# EAGLE schematic Schematic_3ph_MOSFET_Bridge (EAGLE 9.7.0)
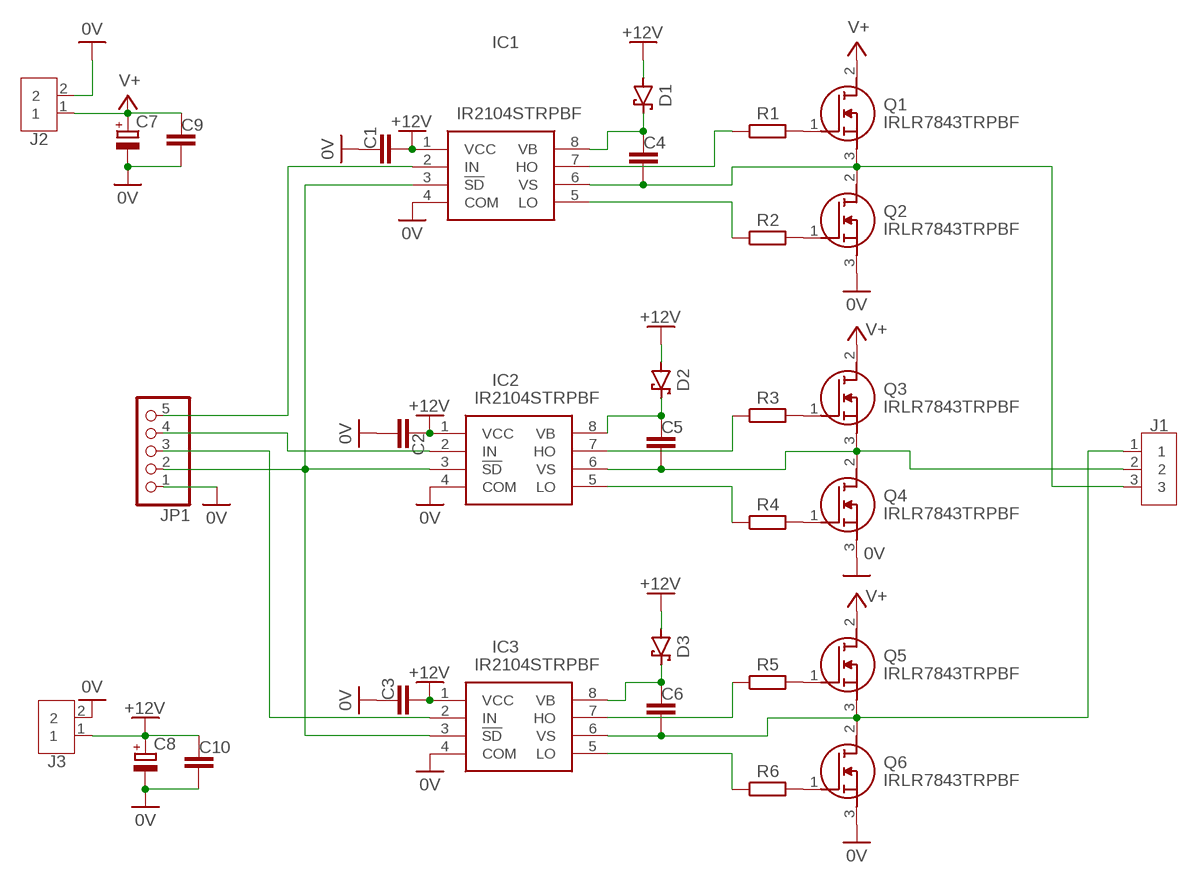
[diagram p0: schematic, sheet 1]

## Parts
C1  CAPACITOR_CHIP-0805(2012-METRIC)  [CAPC2012X110]
C2  CAPACITOR_CHIP-0805(2012-METRIC)  [CAPC2012X110]
C3  CAPACITOR_CHIP-0805(2012-METRIC)  [CAPC2012X110]
C4  CAPACITOR_CHIP-0805(2012-METRIC)  [CAPC2012X110]
C5  CAPACITOR_CHIP-0805(2012-METRIC)  [CAPC2012X110]
C6  CAPACITOR_CHIP-0805(2012-METRIC)  [CAPC2012X110]
C7  C-POL_RADIAL-11MM-DIA  [CAPPRD508W65D1000H1100B]
C8  C-POL_TANTALUM-2412(6032-METRIC)  [CAPMP6032X280N]
C9  CAPACITOR_CHIP-0805(2012-METRIC)  [CAPC2012X110]
C10  CAPACITOR_CHIP-0805(2012-METRIC)  [CAPC2012X110]
D1  MBR0520LT1G  SCHOTTKY_MBR0520LT1GDO-219  [SODFL3718X115]
D2  MBR0520LT1G  SCHOTTKY_MBR0520LT1GDO-219  [SODFL3718X115]
D3  MBR0520LT1G  SCHOTTKY_MBR0520LT1GDO-219  [SODFL3718X115]
IC1  IR2104STRPBF  [SOIC127P600X175-8N]
IC2  IR2104STRPBF  [SOIC127P600X175-8N]
IC3  IR2104STRPBF  [SOIC127P600X175-8N]
J1  TERM-BLK-3P  2828XX-3282837-3  [TERMBLK_508-3N]
J2  TERM-BLK-2P  2828XX-2282837-2  [TERMBLK_508-2N]
J3  TERM-BLK-2P  2828XX-2282837-2  [TERMBLK_508-2N]
JP1  PINHD-1X5  [1X05]
Q1  IRLR7843TRPBF  [IRLR7843TRPBF]
Q2  IRLR7843TRPBF  [IRLR7843TRPBF]
Q3  IRLR7843TRPBF  [IRLR7843TRPBF]
Q4  IRLR7843TRPBF  [IRLR7843TRPBF]
Q5  IRLR7843TRPBF  [IRLR7843TRPBF]
Q6  IRLR7843TRPBF  [IRLR7843TRPBF]
R1  RESISTOR__CHIP-0805(2012-METRIC)  [RESC2012X65]
R2  RESISTOR__CHIP-0805(2012-METRIC)  [RESC2012X65]
R3  RESISTOR__CHIP-0805(2012-METRIC)  [RESC2012X65]
R4  RESISTOR__CHIP-0805(2012-METRIC)  [RESC2012X65]
R5  RESISTOR__CHIP-0805(2012-METRIC)  [RESC2012X65]
R6  RESISTOR__CHIP-0805(2012-METRIC)  [RESC2012X65]

## Nets
0V: C1.1 C2.2 C3.1 C7.2(-) C8.2(-) C9.2 C10.2 IC1.4(COM) IC2.4(COM) IC3.4(COM) J2.2 J3.2 JP1.1 Q2.3(S) Q4.3(S) Q6.3(S)
+12V: C1.2 C2.1 C3.2 C8.1(+) C10.1 D1.2(A) D2.2(A) D3.2(A) IC1.1(VCC) IC2.1(VCC) IC3.1(VCC) J3.1
N$1: C4.2 IC1.6(VS) J1.3 Q1.3(S) Q2.2(D)
N$2: C5.2 IC2.6(VS) J1.2 Q3.3(S) Q4.2(D)
N$3: C6.2 IC3.6(VS) J1.1 Q5.3(S) Q6.2(D)
N$4: Q1.1(G) R1.2
N$5: Q2.1(G) R2.2
N$6: Q3.1(G) R3.2
N$7: Q4.1(G) R4.2
N$8: Q5.1(G) R5.2
N$9: Q6.1(G) R6.2
N$10: IC1.7(HO) R1.1
N$11: IC1.5(LO) R2.1
N$12: IC2.7(HO) R3.1
N$13: IC2.5(LO) R4.1
N$14: IC3.7(HO) R5.1
N$15: IC3.5(LO) R6.1
N$16: IC1.3(!SD) IC2.3(!SD) IC3.3(!SD) JP1.2
N$17: IC1.2(IN) JP1.5
N$18: IC2.2(IN) JP1.4
N$19: IC3.2(IN) JP1.3
N$20: C4.1 D1.1(C) IC1.8(VB)
N$21: C5.1 D2.1(C) IC2.8(VB)
N$22: C6.1 D3.1(C) IC3.8(VB)
V+: C7.1(+) C9.1 J2.1 Q1.2(D) Q3.2(D) Q5.2(D)

## Library data of the parts
C1-C6 C9 C10 = Tinkercad:CAPACITOR: Capacitor - Generic; CATEGORY: Capacitor
C7 C8 = Capacitor:C-POL: Capacitor Polarised - Generic; CATEGORY: Capacitor
D1-D3 = Diode:SCHOTTKY_: Schottky Diode - Popular parts; CATEGORY: Diode; DESCRIPTION: DIODE SCHOTTKY 20V 500MA SOD123; MANUFACTURER: ON Semiconductor; MPN: MBR0520LT1G; SUB-CATEGORY: Schottky
IC1-IC3 = IR2104S:IR2104STRPBF: MOSFET Driver, Dual, 8 Pin, Plastic, SOP Source: Datasheet <https://www.infineon.com/cms/en/product/power/gate-driver-ics/?>; DESCRIPTION: MOSFET Driver, Dual, 8 Pin, Plastic, SOP; HEIGHT: 1.75mm; MANUFACTURER_NAME: Infineon; MANUFACTURER_PART_NUMBER: IR2104STRPBF; MOUSER_PART_NUMBER: 942-IR2104STRPBF; MOUSER_PRICE-STOCK: https://www.mouser.co.uk/ProductDetail/Infineon-Technologies/IR2104STRPBF?qs=2r01AXMCG3NCbspWVHqTYw%3D%3D
J1 = Connector:2828XX-3: 3 Position Wire to Board Terminal Block Horizontal with Board Datasheet <https://www.te.com.cn/commerce/DocumentDelivery/DDEController?Action=showdoc&DocId=Catalog+Section%7F1308389_EUROSTYLE_TERMINAL_BLOCKS%7F0607%7Fpdf%7FEnglish%7FENG_CS_1308389_EUROSTYLE_TERMINAL_BLOCKS_0607.pdf%7F2-282837-5>; CATEGORY: Connector; DESCRIPTION: TERM BLK 3P SIDE ENT 5.08mm PCB; MANUFACTURER: TE Connectivity; MPN: 282837-3; OPERATING_TEMPERATURE: -40°C to +105°C; PART_STATUS: Active; PITCH: 0.200" (5.08mm); ROHS_COMPLIANCE: RoHS Compliant; SERIES: Buchanan; SUBCATEGORY: Terminal Block; TYPE: Side Wire Entry
J2 J3 = Connector:2828XX-2: 2 Position Wire to Board Terminal Block Horizontal with Board Datasheet <https://www.te.com.cn/commerce/DocumentDelivery/DDEController?Action=showdoc&DocId=Catalog+Section%7F1308389_EUROSTYLE_TERMINAL_BLOCKS%7F0607%7Fpdf%7FEnglish%7FENG_CS_1308389_EUROSTYLE_TERMINAL_BLOCKS_0607.pdf%7F2-282837-5>; CATEGORY: Fixed Terminal Blocks; DESCRIPTION: Fixed Terminal Blocks 5.08MM PCB MOUNT 2P; MANUFACTURER: TE Connectivity AMP Connectors; MPN: 282837-2; OPERATING_TEMPERATURE: -40°C to +105°C; PART_STATUS: ACTIVE; PITCH: 0.200" (5.08mm); ROHS_COMPLIANCE: RoHS Compliant; SERIES: Buchanan; SUBCATEGORY: Terminal Blocks; TYPE: Through Hole; Screw - Rising Cage Clamp; Side wire entry, Horizontal with Board
JP1 = Connector:PINHD-1X5: PIN HEADER; CATEGORY: Headers; DESCRIPTION: Header, Straight, 5 Position; MANUFACTURER: Generic; MPN: Generic; OPERATING_TEMPERATURE: Generic; PART_STATUS: Active; PITCH: 0.100" (2.54mm); ROHS_COMPLIANCE: Generic; SERIES: Generic; SUB-CATEGORY: Headers, Male Pins; TYPE: Board to Board or Cable, Unshrouded, Through Hole, Straight
Q1-Q6 = IRLR7843TRPBF:IRLR7843TRPBF: N-Channel 30 V 161A (Tc) 140W (Tc) Surface Mount TO-252AA (DPAK) Source: Datasheet <https://www.infineon.com/dgdl/Infineon-IRLR7843-DataSheet-v01_01-EN.pdf?fileId=5546d462533600a40153566de53526d8>; DESCRIPTION: N-Channel 30 V 161A (Tc) 140W (Tc) Surface Mount TO-252AA (DPAK); HEIGHT: 2.52mm; MANUFACTURER_NAME: Infineon; MANUFACTURER_PART_NUMBER: IRLR7843TRPBF; MOUSER_PART_NUMBER: 942-IRLR7843TRPBF; MOUSER_PRICE-STOCK: https://www.mouser.co.uk/ProductDetail/Infineon-Technologies/IRLR7843TRPBF?qs=Z8%252BeY1k3TIIgO44qG7em9Q%3D%3D
R1-R6 = Tinkercad:RESISTOR: Resistor Fixed - Generic; CATEGORY: Resistor; SUB-CATEGORY: Fixed